# Altium schematic sheet C-04 CPU PERI1.SchDoc
size 513 x 386 mm
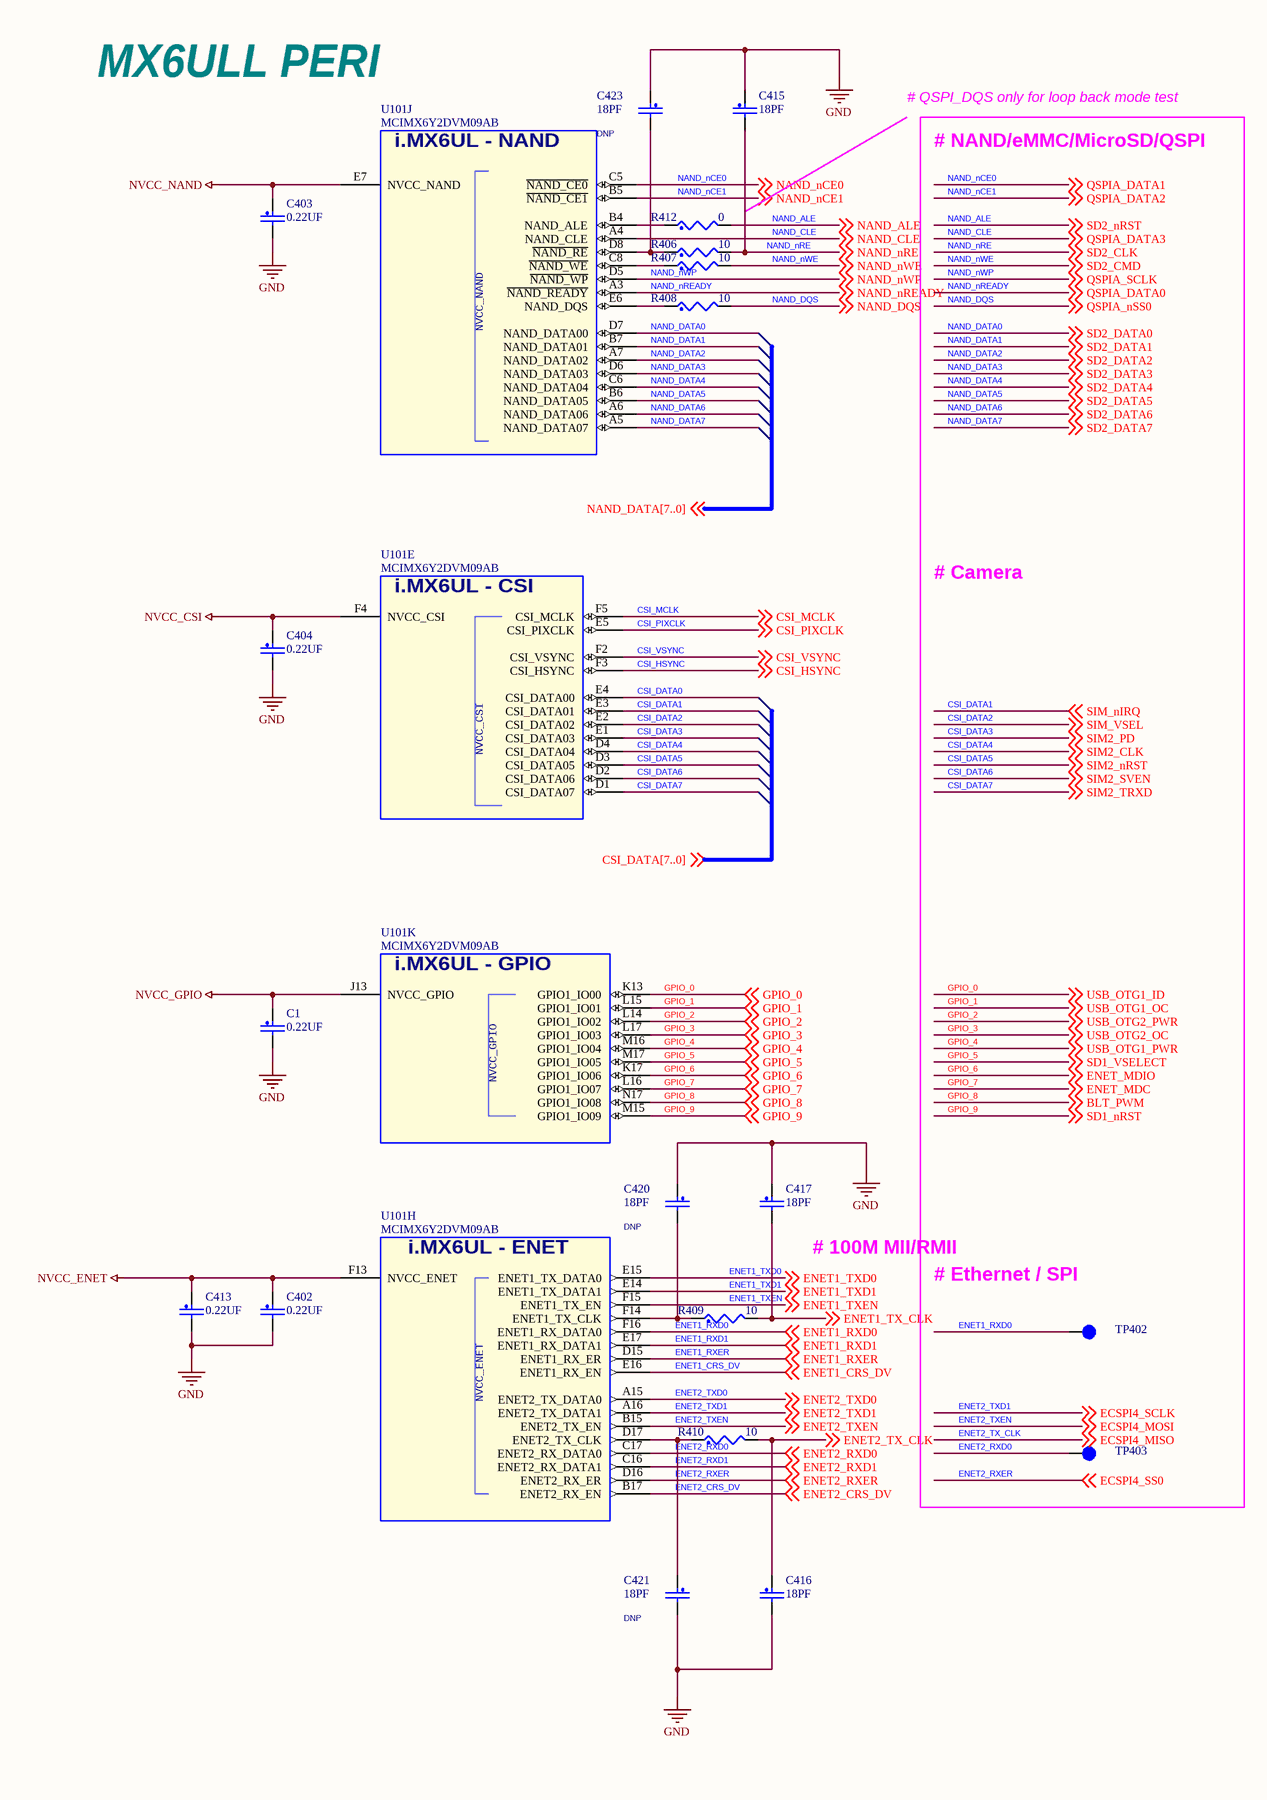
[diagram p0: C-04 CPU PERI1.SchDoc, left]
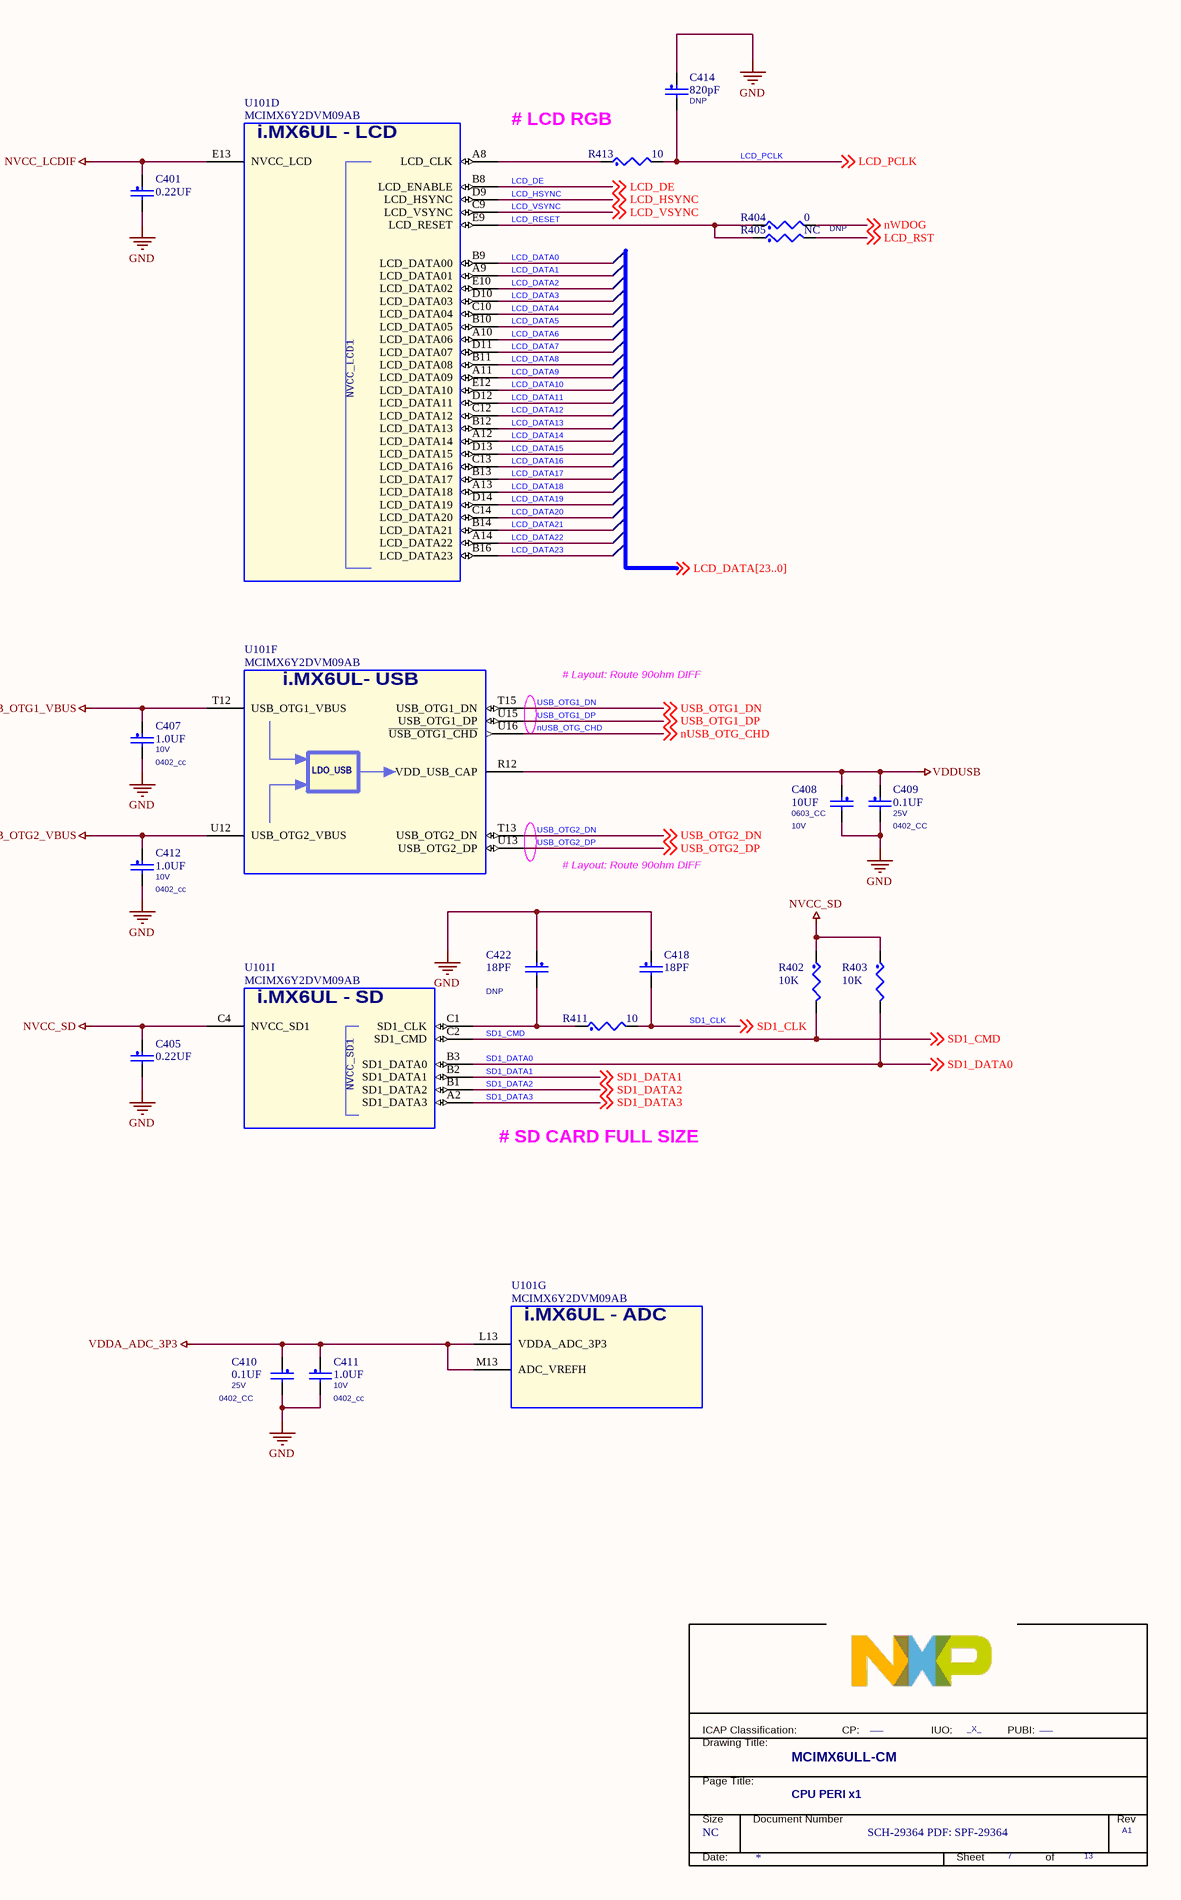
[diagram p1: C-04 CPU PERI1.SchDoc, right]

## Parts
*  PageTitle: CPU PERI x1  Page Count: 13  Page Number: 7  Page Size: NC  Title: MCIMX6ULL-CM  RevCode: A1  Doc: SCH-29364 PDF: SPF-29364  FCP: ___  FIUO: _X_  (hidden comment: TitleBlock_FS)  (graphical)
C1  0.22UF  [0402T_C]
C401  0.22UF  [0402T_C]
C402  0.22UF  [0402T_C]
C403  0.22UF  [0402T_C]
C404  0.22UF  [0402T_C]
C405  0.22UF  [0402T_C]
C407  1.0UF  VOLTAGE: 10V  PCB Footprint: 0402_cc  [0402T_C]
C408  10UF  VOLTAGE: 10V  PCB Footprint: 0603_CC  [0402T_C]
C409  0.1UF  VOLTAGE: 25V  PCB Footprint: 0402_CC  [0402T_C]
C410  0.1UF  VOLTAGE: 25V  PCB Footprint: 0402_CC  [0402T_C]
C411  1.0UF  VOLTAGE: 10V  PCB Footprint: 0402_cc  [0402T_C]
C412  1.0UF  VOLTAGE: 10V  PCB Footprint: 0402_cc  [0402T_C]
C413  0.22UF  [0402T_C]
C414  820pF  ASSY_OPT: DNP  [0402T_C]
C415  18PF  [0402T_C]
C416  18PF  [0402T_C]
C417  18PF  [0402T_C]
C418  18PF  [0402T_C]
C420  18PF  ASSY_OPT: DNP  [0402T_C]
C421  18PF  ASSY_OPT: DNP  [0402T_C]
C422  18PF  ASSY_OPT: DNP  [0402T_C]
C423  18PF  ASSY_OPT: DNP  [0402T_C]
R402  10K  [0402T_C]
R403  10K  [0402T_C]
R404  0  [0603_CC]
R405  NC  ASSY_OPT: DNP  [0402T_C]
R406  10  [0402T_C]
R407  10  [0402T_C]
R408  10  [0402T_C]
R409  10  [0402T_C]
R410  10  [0402T_C]
R411  10  [0402T_C]
R412  0  [0402T_C]
R413  10  [0402T_C]
TP402  TPAD_015  [TPAD_015]  (value not drawn)
TP403  TPAD_015  [TPAD_015]  (value not drawn)
U101  MCIMX6Y2DVM09AB  [BGA289_0P8_14X14]  (parts D,E,F,G,H,I,J,K of 11)

## Nets
GND: C1.2 C401.2 C402.2 C403.2 C404.2 C405.2 C407.2 C408.2 C409.2 C410.2 C411.2 C412.2 C413.2 C414.1 C415.1 C416.2 C417.1 C418.1 C420.1 C421.2 C422.1 C423.1
NVCC_CSI: C404.1 U101.F4(NVCC_CSI)
NVCC_ENET: C402.1 C413.1 U101.F13(NVCC_ENET)
NVCC_GPIO: C1.1 U101.J13(NVCC_GPIO)
NVCC_LCDIF: C401.1 U101.E13(NVCC_LCD)
NVCC_NAND: C403.1 U101.E7(NVCC_NAND)
NVCC_SD: C405.1 R402.1 R403.1 U101.C4(NVCC_SD1)
USB_OTG1_VBUS: C407.1 U101.T12(USB_OTG1_VBUS)
USB_OTG2_VBUS: C412.1 U101.U12(USB_OTG2_VBUS)
VDDA_ADC_3P3: C410.1 C411.1 U101.L13(VDDA_ADC_3P3) U101.M13(ADC_VREFH)
VDDUSB: C408.1 C409.1 U101.R12(VDD_USB_CAP)
CSI_DATA0: U101.E4(CSI_DATA00)
CSI_DATA1: U101.E3(CSI_DATA01) ; off-sheet SIM_nIRQ  [also labelled SIM_nIRQ]
CSI_DATA2: U101.E2(CSI_DATA02) ; off-sheet SIM_VSEL  [also labelled SIM_VSEL]
CSI_DATA3: U101.E1(CSI_DATA03) ; off-sheet SIM2_PD  [also labelled SIM2_PD]
CSI_DATA4: U101.D4(CSI_DATA04) ; off-sheet SIM2_CLK  [also labelled SIM2_CLK]
CSI_DATA5: U101.D3(CSI_DATA05) ; off-sheet SIM2_nRST  [also labelled SIM2_nRST]
CSI_DATA6: U101.D2(CSI_DATA06) ; off-sheet SIM2_SVEN  [also labelled SIM2_SVEN]
CSI_DATA7: U101.D1(CSI_DATA07) ; off-sheet SIM2_TRXD  [also labelled SIM2_TRXD]
CSI_HSYNC: U101.F3(CSI_HSYNC) ; off-sheet CSI_HSYNC
CSI_MCLK: U101.F5(CSI_MCLK) ; off-sheet CSI_MCLK
CSI_PIXCLK: U101.E5(CSI_PIXCLK) ; off-sheet CSI_PIXCLK
CSI_VSYNC: U101.F2(CSI_VSYNC) ; off-sheet CSI_VSYNC
ENET1_CRS_DV: U101.E16(ENET1_RX_EN) ; off-sheet ENET1_CRS_DV
ENET1_RXD0: TP402.1(Pin1) U101.F16(ENET1_RX_DATA0) ; off-sheet ENET1_RXD0
ENET1_RXD1: U101.E17(ENET1_RX_DATA1) ; off-sheet ENET1_RXD1
ENET1_RXER: U101.D15(ENET1_RX_ER) ; off-sheet ENET1_RXER
ENET1_TX_CLK: C417.2 R409.2 ; off-sheet ENET1_TX_CLK
ENET1_TXD0: U101.E15(ENET1_TX_DATA0) ; off-sheet ENET1_TXD0
ENET1_TXD1: U101.E14(ENET1_TX_DATA1) ; off-sheet ENET1_TXD1
ENET1_TXEN: U101.F15(ENET1_TX_EN) ; off-sheet ENET1_TXEN
ENET2_CRS_DV: U101.B17(ENET2_RX_EN) ; off-sheet ENET2_CRS_DV
ENET2_RXD0: TP403.1(Pin1) U101.C17(ENET2_RX_DATA0) ; off-sheet ENET2_RXD0
ENET2_RXD1: U101.C16(ENET2_RX_DATA1) ; off-sheet ENET2_RXD1
ENET2_RXER: U101.D16(ENET2_RX_ER) ; off-sheet ENET2_RXER, off-sheet ECSPI4_SS0  [also labelled ECSPI4_SS0]
ENET2_TX_CLK: C416.1 R410.2 ; off-sheet ENET2_TX_CLK, off-sheet ECSPI4_MISO  [also labelled ECSPI4_MISO]
ENET2_TXD0: U101.A15(ENET2_TX_DATA0) ; off-sheet ENET2_TXD0
ENET2_TXD1: U101.A16(ENET2_TX_DATA1) ; off-sheet ENET2_TXD1, off-sheet ECSPI4_SCLK  [also labelled ECSPI4_SCLK]
ENET2_TXEN: U101.B15(ENET2_TX_EN) ; off-sheet ENET2_TXEN, off-sheet ECSPI4_MOSI  [also labelled ECSPI4_MOSI]
GPIO_0: U101.K13(GPIO1_IO00) ; off-sheet GPIO_0, off-sheet USB_OTG1_ID  [also labelled USB_OTG1_ID]
GPIO_1: U101.L15(GPIO1_IO01) ; off-sheet GPIO_1, off-sheet USB_OTG1_OC  [also labelled USB_OTG1_OC]
GPIO_2: U101.L14(GPIO1_IO02) ; off-sheet GPIO_2, off-sheet USB_OTG2_PWR  [also labelled USB_OTG2_PWR]
GPIO_3: U101.L17(GPIO1_IO03) ; off-sheet GPIO_3, off-sheet USB_OTG2_OC  [also labelled USB_OTG2_OC]
GPIO_4: U101.M16(GPIO1_IO04) ; off-sheet GPIO_4, off-sheet USB_OTG1_PWR  [also labelled USB_OTG1_PWR]
GPIO_5: U101.M17(GPIO1_IO05) ; off-sheet SD1_VSELECT, off-sheet GPIO_5  [also labelled SD1_VSELECT]
GPIO_6: U101.K17(GPIO1_IO06) ; off-sheet ENET_MDIO, off-sheet GPIO_6  [also labelled ENET_MDIO]
GPIO_7: U101.L16(GPIO1_IO07) ; off-sheet ENET_MDC, off-sheet GPIO_7  [also labelled ENET_MDC]
GPIO_8: U101.N17(GPIO1_IO08) ; off-sheet BLT_PWM, off-sheet GPIO_8  [also labelled BLT_PWM]
GPIO_9: U101.M15(GPIO1_IO09) ; off-sheet SD1_nRST, off-sheet GPIO_9  [also labelled SD1_nRST]
LCD_DATA0: U101.B9(LCD_DATA00)
LCD_DATA1: U101.A9(LCD_DATA01)
LCD_DATA2: U101.E10(LCD_DATA02)
LCD_DATA3: U101.D10(LCD_DATA03)
LCD_DATA4: U101.C10(LCD_DATA04)
LCD_DATA5: U101.B10(LCD_DATA05)
LCD_DATA6: U101.A10(LCD_DATA06)
LCD_DATA7: U101.D11(LCD_DATA07)
LCD_DATA8: U101.B11(LCD_DATA08)
LCD_DATA9: U101.A11(LCD_DATA09)
LCD_DATA10: U101.E12(LCD_DATA10)
LCD_DATA11: U101.D12(LCD_DATA11)
LCD_DATA12: U101.C12(LCD_DATA12)
LCD_DATA13: U101.B12(LCD_DATA13)
LCD_DATA14: U101.A12(LCD_DATA14)
LCD_DATA15: U101.D13(LCD_DATA15)
LCD_DATA16: U101.C13(LCD_DATA16)
LCD_DATA17: U101.B13(LCD_DATA17)
LCD_DATA18: U101.A13(LCD_DATA18)
LCD_DATA19: U101.D14(LCD_DATA19)
LCD_DATA20: U101.C14(LCD_DATA20)
LCD_DATA21: U101.B14(LCD_DATA21)
LCD_DATA22: U101.A14(LCD_DATA22)
LCD_DATA23: U101.B16(LCD_DATA23)
LCD_DE: U101.B8(LCD_ENABLE) ; off-sheet LCD_DE
LCD_HSYNC: U101.D9(LCD_HSYNC) ; off-sheet LCD_HSYNC
LCD_PCLK: C414.2 R413.2 ; off-sheet LCD_PCLK
LCD_RESET: R404.1 R405.1 U101.E9(LCD_RESET)
LCD_RST: R405.2 ; off-sheet LCD_RST
LCD_VSYNC: U101.C9(LCD_VSYNC) ; off-sheet LCD_VSYNC
NAND_ALE: R412.2 ; off-sheet NAND_ALE, off-sheet SD2_nRST  [also labelled SD2_nRST]
NAND_CLE: U101.A4(NAND_CLE) ; off-sheet NAND_CLE, off-sheet QSPIA_DATA3  [also labelled QSPIA_DATA3]
NAND_DATA0: U101.D7(NAND_DATA00) ; off-sheet SD2_DATA0  [also labelled SD2_DATA0]
NAND_DATA1: U101.B7(NAND_DATA01) ; off-sheet SD2_DATA1  [also labelled SD2_DATA1]
NAND_DATA2: U101.A7(NAND_DATA02) ; off-sheet SD2_DATA2  [also labelled SD2_DATA2]
NAND_DATA3: U101.D6(NAND_DATA03) ; off-sheet SD2_DATA3  [also labelled SD2_DATA3]
NAND_DATA4: U101.C6(NAND_DATA04) ; off-sheet SD2_DATA4  [also labelled SD2_DATA4]
NAND_DATA5: U101.B6(NAND_DATA05) ; off-sheet SD2_DATA5  [also labelled SD2_DATA5]
NAND_DATA6: U101.A6(NAND_DATA06) ; off-sheet SD2_DATA6  [also labelled SD2_DATA6]
NAND_DATA7: U101.A5(NAND_DATA07) ; off-sheet SD2_DATA7  [also labelled SD2_DATA7]
NAND_DQS: R408.2 ; off-sheet NAND_DQS, off-sheet QSPIA_nSS0  [also labelled QSPIA_nSS0]
NAND_nCE0: U101.C5(~{NAND_CE0}) ; off-sheet NAND_nCE0, off-sheet QSPIA_DATA1  [also labelled QSPIA_DATA1]
NAND_nCE1: U101.B5(~{NAND_CE1}) ; off-sheet NAND_nCE1, off-sheet QSPIA_DATA2  [also labelled QSPIA_DATA2]
NAND_nRE: C415.2 R406.2 ; off-sheet NAND_nRE, off-sheet SD2_CLK  [also labelled SD2_CLK]
NAND_nREADY: U101.A3(~{NAND_READY}) ; off-sheet NAND_nREADY, off-sheet QSPIA_DATA0  [also labelled QSPIA_DATA0]
NAND_nWE: R407.2 ; off-sheet NAND_nWE, off-sheet SD2_CMD  [also labelled SD2_CMD]
NAND_nWP: U101.D5(~{NAND_WP}) ; off-sheet NAND_nWP, off-sheet QSPIA_SCLK  [also labelled QSPIA_SCLK]
nUSB_OTG_CHD: U101.U16(~{USB_OTG1_CHD}) ; off-sheet nUSB_OTG_CHD
nWDOG: R404.2 ; off-sheet nWDOG
SD1_CLK: C418.2 R411.2 ; off-sheet SD1_CLK
SD1_CMD: R402.2 U101.C2(SD1_CMD) ; off-sheet SD1_CMD
SD1_DATA0: R403.2 U101.B3(SD1_DATA0) ; off-sheet SD1_DATA0
SD1_DATA1: U101.B2(SD1_DATA1) ; off-sheet SD1_DATA1
SD1_DATA2: U101.B1(SD1_DATA2) ; off-sheet SD1_DATA2
SD1_DATA3: U101.A2(SD1_DATA3) ; off-sheet SD1_DATA3
USB_OTG1_DN: U101.T15(USB_OTG1_DN) ; off-sheet USB_OTG1_DN
USB_OTG1_DP: U101.U15(USB_OTG1_DP) ; off-sheet USB_OTG1_DP
USB_OTG2_DN: U101.T13(USB_OTG2_DN) ; off-sheet USB_OTG2_DN
USB_OTG2_DP: U101.U13(USB_OTG2_DP) ; off-sheet USB_OTG2_DP
NetC420_2: C420.2 R409.1 U101.F14(ENET1_TX_CLK)
NetC421_1: C421.1 R410.1 U101.D17(ENET2_TX_CLK)
NetC422_2: C422.2 R411.1 U101.C1(SD1_CLK)
NetC423_2: C423.2 R406.1 U101.D8(~{NAND_RE})
NetR407_1: R407.1 U101.C8(~{NAND_WE})
NetR408_1: R408.1 U101.E6(NAND_DQS)
NetR412_1: R412.1 U101.B4(NAND_ALE)
NetR413_1: R413.1 U101.A8(LCD_CLK)

## Notes on the sheet
- MX6ULL PERI
- # QSPI_DQS only for loop back mode test
- # NAND/eMMC/MicroSD/QSPI
- (near R413) # LCD RGB
- # Camera
- # Layout: Route 90ohm DIFF
- (near C417) # 100M MII/RMII
- # SD CARD FULL SIZE
- (near TP402) # Ethernet / SPI
- (in symbol MCIMX6Y2DVM05AA_PBGA_289P, part D) i.MX6UL - LCD; NVCC_LCD1
- (in symbol MCIMX6Y2DVM05AA_PBGA_289P, part E) i.MX6UL - CSI
- (in symbol MCIMX6Y2DVM05AA_PBGA_289P, part F) i.MX6UL- USB; LDO_USB
- (in symbol MCIMX6Y2DVM05AA_PBGA_289P, part G) i.MX6UL - ADC
- (in symbol MCIMX6Y2DVM05AA_PBGA_289P, part H) i.MX6UL - ENET
- (in symbol MCIMX6Y2DVM05AA_PBGA_289P, part I) i.MX6UL - SD
- (in symbol MCIMX6Y2DVM05AA_PBGA_289P, part J) i.MX6UL - NAND
- (in symbol MCIMX6Y2DVM05AA_PBGA_289P, part K) i.MX6UL - GPIO
- (in symbol TitleBlock_FS) ICAP Classification:; CP:; IUO:; PUBI:; Drawing Title:; Page Title:; Size; Document Number; Rev; Date:; Sheet; of

## Library data of the parts
* = TitleBlock_FS: OrgAddr2: Austin, TX 78735-8598; OrgAddr1: 6501 William Cannon Drive West; OrgName: Freescale Semiconductor; Page Create Date: March  8, 1995; PUBI: ___; Page Modify Date: *
C1 C401-C403 C413 = CAP_NP: CAP CER 0.22UF 10V 10% X5R 0402; CLASS: DISCRETE; PCB Footprint: 0402_CC; FPLIST: CC0402_25,CC0402_HD,0402_CC; CAD_APPROVED: Yes; MFG_PN01: NMC0402X5R224K10TRPF; MFG_NAME01: NIC COMPONENTS CORP; AGILE_PN: 150-77358; VOLTAGE: 10V; HEIGHT: 0.55MM; ROHS: Yes; Tolerance: 10%
C404 C405 = CAP_NP: CAP CER 0.22UF 10V 10% X5R 0402; CLASS: DISCRETE; PCB Footprint: 0402_CC; AGILE_PN: 150-77358; MFG_NAME01: NIC COMPONENTS CORP; MFG_PN01: NMC0402X5R224K10TRPF; CAD_APPROVED: Yes; FPLIST: CC0402_25,CC0402_HD,0402_CC; Tolerance: 10%; ROHS: Yes; HEIGHT: 0.55MM; VOLTAGE: 10V
C407 C411 C412 = CAP_NP: CAP CER 1.0UF 10V 10% X5R 0402; CLASS: DISCRETE; FPLIST: CC0402_25,CC0402_HD,0402_CC; CAD_APPROVED: Yes; MFG_PN01: CC0402KRX5R6BB105; MFG_NAME01: YAGEO AMERICA; AGILE_PN: 150-75772; HEIGHT: 0.6MM; ROHS: Yes
C408 = CAP_NP: CAP CER 10UF 10V 20% X5R 0603; CLASS: DISCRETE; FPLIST: CC0603_OV,CC0603,0603_CC; CAD_APPROVED: Yes; MFG_PN01: LMK107BJ106MALTD; MFG_NAME01: TAIYO YUDEN; AGILE_PN: 150-78609; HEIGHT: 1.016MM; ROHS: Yes
C409 = CAP_NP: CAP CER 0.1UF 25V 10% X5R 0402; CLASS: DISCRETE; FPLIST: CC0402_25,CC0402_HD,0402_CC; CAD_APPROVED: Yes; MFG_PN01: CC0402KRX5R8BB104; MFG_NAME01: YAGEO AMERICA; AGILE_PN: 150-78633; HEIGHT: 0.55MM; ROHS: Yes; Tolerance: 10%
C410 = CAP_NP: CAP CER 0.1UF 25V 10% X5R 0402; CLASS: DISCRETE; AGILE_PN: 150-78633; MFG_NAME01: YAGEO AMERICA; MFG_PN01: CC0402KRX5R8BB104; CAD_APPROVED: Yes; FPLIST: CC0402_25,CC0402_HD,0402_CC; Tolerance: 10%; ROHS: Yes; HEIGHT: 0.55MM
C414 = CAP_NP: CAP CER 820PF 50V 5% X7R 0402; CLASS: DISCRETE; AGILE_PN: 150-77973; MFG_NAME01: KEMET; MFG_PN01: C0402C821J5RAC; CAD_APPROVED: Yes; FPLIST: CC0402_25,CC0402_HD,0402_CC; PCB Footprint: 0402_CC; Tolerance: 5%; ROHS: Yes; HEIGHT: 0.6MM; VOLTAGE: 50 V
C415-C417 C420 C421 C423 = CAP_NP: CAP CER 18PF 50V 1% C0G 0402; CLASS: DISCRETE; ROOM: ATLAS-AP; PRIORITY_PN: 021-00248; CAD_APPROVED: Yes; MFG_PN01: CC0402FRNPO9BN180; MFG_NAME01: YAGEO; AGILE_PN: 150-76630; FPLIST: CC0402_25,CC0402_HD,0402_CC; PCB Footprint: 0402_CC; VOLTAGE: 50V; HEIGHT: 0.59MM; ROHS: Yes; Tolerance: 1%
C418 C422 = CAP_NP: CAP CER 18PF 50V 1% C0G 0402; CLASS: DISCRETE; FPLIST: CC0402_25,CC0402_HD,0402_CC; AGILE_PN: 150-76630; MFG_NAME01: YAGEO; MFG_PN01: CC0402FRNPO9BN180; CAD_APPROVED: Yes; PRIORITY_PN: 021-00248; ROOM: ATLAS-AP; PCB Footprint: 0402_CC; VOLTAGE: 50V; Tolerance: 1%; ROHS: Yes; HEIGHT: 0.59MM
R402 R403 = RES: RES MF 10K 1/16W 5% 0402; CLASS: DISCRETE; AGILE_PN: 470-75557; MFG_NAME01: VISHAY INTERTECHNOLOGY; MFG_PN01: CRCW040210K0JNED; CAD_APPROVED: Yes; FPLIST: RC0402_25,RC0402_HD,0402_CC; PCB Footprint: 0402_CC; HEIGHT: 0.4 MM; Tolerance: 5%; ROHS: Yes
R404 R405 = RES: RES MF ZERO OHM 1/16W 5% 0402; CLASS: DISCRETE; FPLIST: RC0402_25,RC0402_HD,RC0402_X2,0402_CC; CAD_APPROVED: Yes; MFG_PN01: MCR01MZPJ000; MFG_NAME01: ROHM; AGILE_PN: 470-75394; PCB Footprint: 0402_CC; HEIGHT: 0.45 MM; ROHS: Yes; Tolerance: 5%
R406 R409-R411 R413 = RES: RES MF 10 OHM 1/16W 5% 0402; CLASS: DISCRETE; AGILE_PN: 470-75589; MFG_NAME01: VENKEL COMPANY; MFG_PN01: CR0402-16W-100JT; CAD_APPROVED: Yes; FPLIST: RC0402_25,RC0402_HD,0402_CC; PCB Footprint: 0402_CC; HEIGHT: 0.4MM; Tolerance: 5%; ROHS: Yes
R407 R408 = RES: RES MF 10 OHM 1/16W 5% 0402; CLASS: DISCRETE; FPLIST: RC0402_25,RC0402_HD,0402_CC; CAD_APPROVED: Yes; MFG_PN01: CR0402-16W-100JT; MFG_NAME01: VENKEL COMPANY; AGILE_PN: 470-75589; PCB Footprint: 0402_CC; HEIGHT: 0.4MM; ROHS: Yes; Tolerance: 5%
R412 = RES: RES MF ZERO OHM 1/16W 5% 0402; CLASS: DISCRETE; AGILE_PN: 470-75394; MFG_NAME01: ROHM; MFG_PN01: MCR01MZPJ000; CAD_APPROVED: Yes; FPLIST: RC0402_25,RC0402_HD,RC0402_X2,0402_CC; PCB Footprint: 0402_CC; HEIGHT: 0.45 MM; Tolerance: 5%; ROHS: Yes
TP402 = TESTLOOP: TEST POINT PAD 15MIL DIA SMT, NO PART TO ORDER; CLASS: IO; AGILE_PN: 211-76645; MFG_NAME01: NOTACOMPONENT; CAD_APPROVED: Yes; MFG_PN01: NOTACOMPONENT; ROHS: Yes; HEIGHT: 0.1MM; PCB Footprint: TPAD_015
TP403 = TESTLOOP: TEST POINT PAD 15MIL DIA SMT, NO PART TO ORDER; CLASS: IO; CAD_APPROVED: Yes; MFG_PN01: NOTACOMPONENT; AGILE_PN: 211-76645; HEIGHT: 0.1MM; ROHS: Yes; MFG_NAME01: NOTACOMPONENT; PCB Footprint: TPAD_015
U101 = MCIMX6Y2DVM05AA_PBGA_289P: IC CPU ARM COREA7 900MHZ 16BIT 3-3.6V PBGA289; AGILE_PN: TMP-WF-33487; MFG_NAME01: NXP SEMICONDUCTORS; Temp_Range: 0C to +95C; PRE_APN: 330-77080; CAD_APPROVED: Yes; CLASS: IC; MFG_PN01: MCIMX6Y2DVM09AB; ROHS: Yes; HEIGHT: 1.32MM; PCB Footprint: BGA289_0P8_14X14